# EAGLE design facetHound_base_module_v12 (EAGLE 9.6.2)
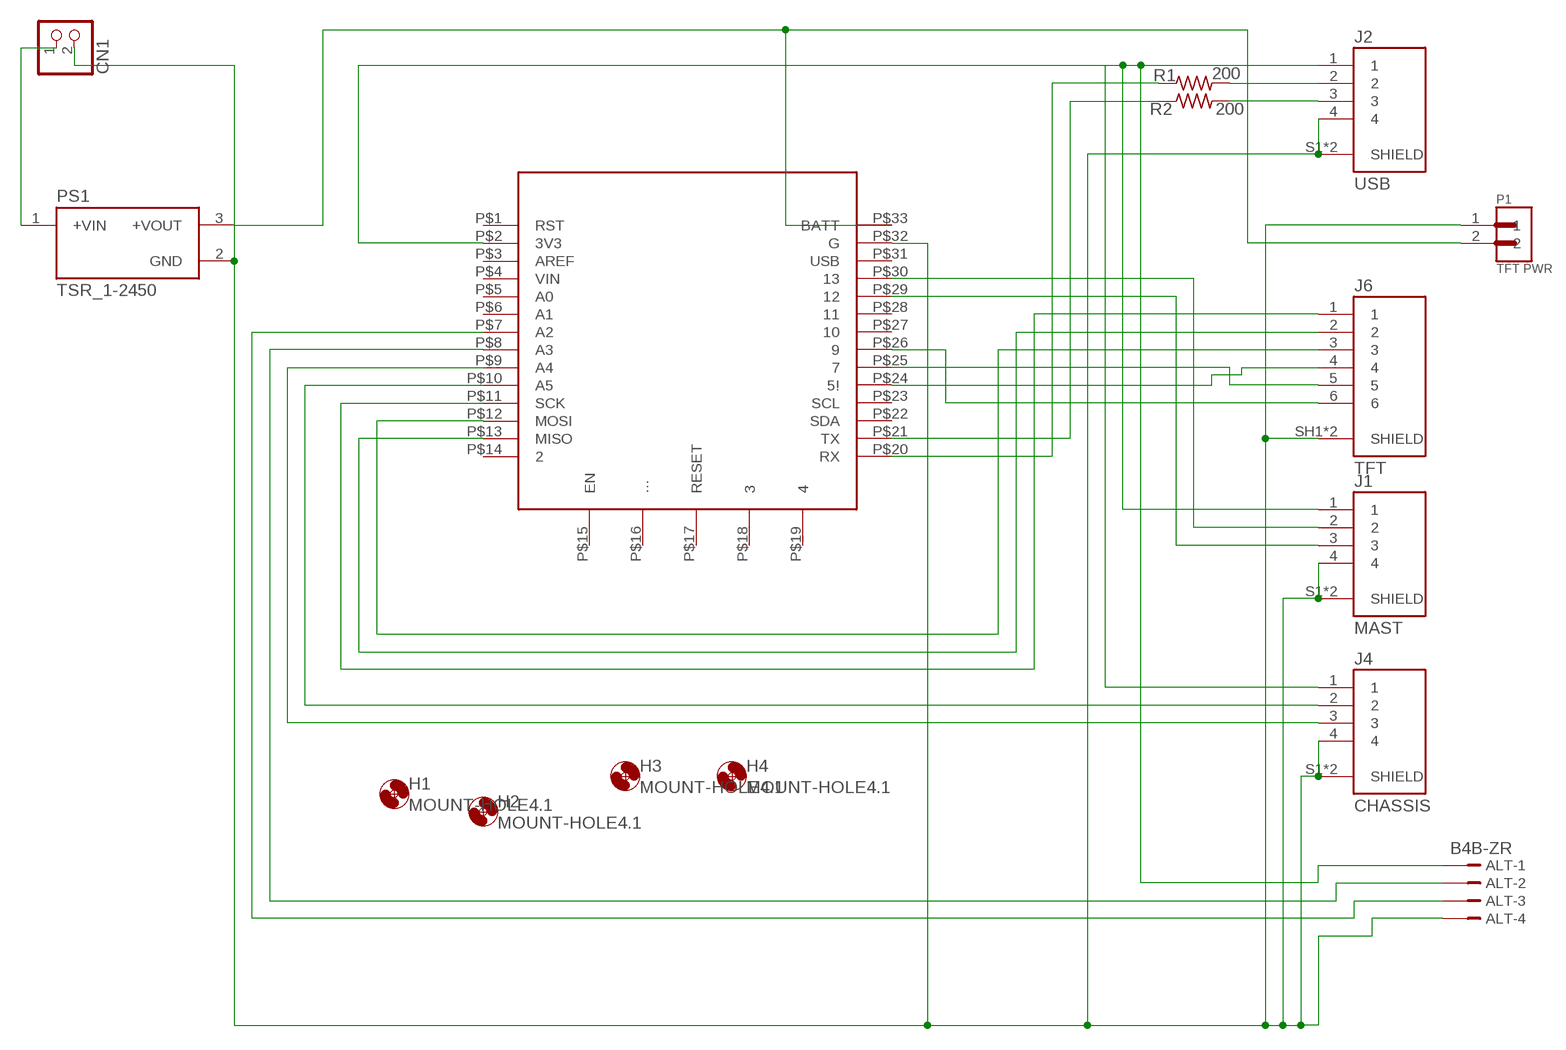
[diagram p0: schematic, sheet 1]

## Parts
ALT  B4B-ZR  [B4B-ZR]
CN1  JST_2PIN-THM-RA  [JST-PH-2-THM-RA]
H1  MOUNT-HOLE4.1  [4,1]
H2  MOUNT-HOLE4.1  [4,1]
H3  MOUNT-HOLE4.1  [4,1]
H4  MOUNT-HOLE4.1  [4,1]
J1  MAST  S4B-ZR-SM4A-TF(LF)(SN)  [JST_S4B-ZR-SM4A-TF(LF)(SN)]
J2  USB  S4B-ZR-SM4A-TF(LF)(SN)  [JST_S4B-ZR-SM4A-TF(LF)(SN)]
J4  CHASSIS  S4B-ZR-SM4A-TF(LF)(SN)  [JST_S4B-ZR-SM4A-TF(LF)(SN)]
J6  TFT  S6B-ZR-SM4A-TF(LF)(SN)  [JST_S6B-ZR-SM4A-TF(LF)(SN)]
P1  TFT PWR  S2B-ZR-SM4A-TF  [JST_S2B-ZR-SM4A-TF]
PS1  TSR_1-2450  [CONV_TSR_1-2450]
R1  200  R-US_M1206  [M1206]
R2  200  R-US_M1206  [M1206]
U$1  ITSYBITSY_M4  [ITSYBITSY_M4]

## Nets
GND: ALT.4 CN1.2 J1.4 J1.S1(SHIELD) J1.S2(SHIELD) J2.4 J2.S1(SHIELD) J2.S2(SHIELD) J4.4 J4.S1(SHIELD) J4.S2(SHIELD) J6.SH1(SHIELD) J6.SH2(SHIELD) P1.1 PS1.2(GND) U$1.P$32(G)
N$1: CN1.1 PS1.1(+VIN)
N$2: P1.2 PS1.3(+VOUT) U$1.P$33(BATT)
N$3: R2.1 U$1.P$21(TX)
N$4: ALT.3 U$1.P$7(A2)
N$5: J6.1 U$1.P$11(SCK)
N$6: ALT.1 J1.1 J2.1 J4.1 U$1.P$2(3V3)
N$7: J6.2 U$1.P$13(MISO)
N$8: J2.2 R1.2
N$9: R1.1 U$1.P$20(RX)
N$10: J6.3 U$1.P$12(MOSI)
N$11: J6.5 U$1.P$25
N$12: J6.4 U$1.P$24(5!)
N$13: J6.6 U$1.P$26
N$14: J1.2 U$1.P$30
N$15: J1.3 U$1.P$29
N$16: J4.2 U$1.P$10(A5)
N$17: J4.3 U$1.P$9(A4)
N$19: J2.3 R2.2
N$21: ALT.2 U$1.P$8(A3)
Unconnected: U$1.P$1(RST) U$1.P$3(AREF) U$1.P$4(VIN) U$1.P$5(A0) U$1.P$6(A1) U$1.P$14 U$1.P$15(EN) U$1.P$16(...) U$1.P$17(RESET) U$1.P$18 U$1.P$19 U$1.P$22(SDA) U$1.P$23(SCL) U$1.P$27 U$1.P$28 U$1.P$31(USB)

## Library data of the parts
ALT = con-jst:?4B-ZR: ZH CONNECTOR 1.5 mm, 4 pin 1 row Source: http://www.jst.com .. eZH.pdf; MF: FARNELL; MPN: B4B-ZR(LF)(SN); OC_FARNELL: 1830916; OC_NEWARK: 37K9960
CN1 = adafruit:JST_2PIN: JST 2-Pin Connectors of various flavors SMT-RA (S2B-PH-SM4) 4UConnector #17311 SMT (B2B-PH-SM4) THM-RA (S2B-PH) THM (B2B-PH)
H1-H4 = holes:MOUNT-HOLE: MOUNTING HOLE with drill center marker
J1 J2 J4 = S4B-ZR-SM4A-TF_LF__SN_:S4B-ZR-SM4A-TF(LF)(SN): Check availability <https://pricing.snapeda.com/parts/S4B-ZR-SM4A-TF%28LF%29%28SN%29/JST%20Sales/view-part?ref=eda>; AVAILABILITY: In Stock; CHECK_PRICES: https://www.snapeda.com/parts/S4B-ZR-SM4A-TF(LF)(SN)/JST/view-part/?ref=eda; DESCRIPTION: Connector Header Surface Mount, Right Angle 4 position 0.059 (1.50mm); MF: JST Sales; MP: S4B-ZR-SM4A-TF(LF)(SN); PACKAGE: None; PRICE: None; SNAPEDA_LINK: https://www.snapeda.com/parts/S4B-ZR-SM4A-TF(LF)(SN)/JST/view-part/?ref=snap
J6 = S6B-ZR-SM4A-TF_LF__SN_:S6B-ZR-SM4A-TF(LF)(SN): Check availability <https://pricing.snapeda.com/parts/S6B-ZR-SM4A-TF%28LF%29%28SN%29/JST%20Sales%20America%20Inc./view-part?ref=eda>; AVAILABILITY: In Stock; CHECK_PRICES: https://www.snapeda.com/parts/S6B-ZR-SM4A-TF(LF)(SN)/JST/view-part/?ref=eda; DESCRIPTION: Connector Header Surface Mount, Right Angle 6 position 0.059 (1.50mm); MF: JST Sales America Inc.; MP: S6B-ZR-SM4A-TF(LF)(SN); PACKAGE: None; PRICE: None; SNAPEDA_LINK: https://www.snapeda.com/parts/S6B-ZR-SM4A-TF(LF)(SN)/JST/view-part/?ref=snap
P1 = S2B-ZR-SM4A-TF:S2B-ZR-SM4A-TF: Check availability <https://pricing.snapeda.com/parts/S2B-ZR-SM4A-TF/JST%20Sales/view-part?ref=eda>; AVAILABILITY: In Stock; CHECK_PRICES: https://www.snapeda.com/parts/S2B-ZR-SM4A-TF/JST/view-part/?ref=eda; DESCRIPTION: Connector Header Surface Mount, Right Angle 2 position 0.059 (1.50mm); MF: JST Sales; MP: S2B-ZR-SM4A-TF; PACKAGE: None; PRICE: None; SNAPEDA_LINK: https://www.snapeda.com/parts/S2B-ZR-SM4A-TF/JST/view-part/?ref=snap
PS1 = TSR_1-2450:TSR_1-2450; MANUFACTURER: Traco Power; MAXIMUM_PACKAGE_HEIGHT: 10.6mm; PARTREV: Apr 27, 2020; STANDARD: Manufacturer Recommendations
R1 R2 = adafruit:R-US_: RESISTOR, American symbol
U$1 = itsyBitsy:ITSYBITSY_M4

## Board
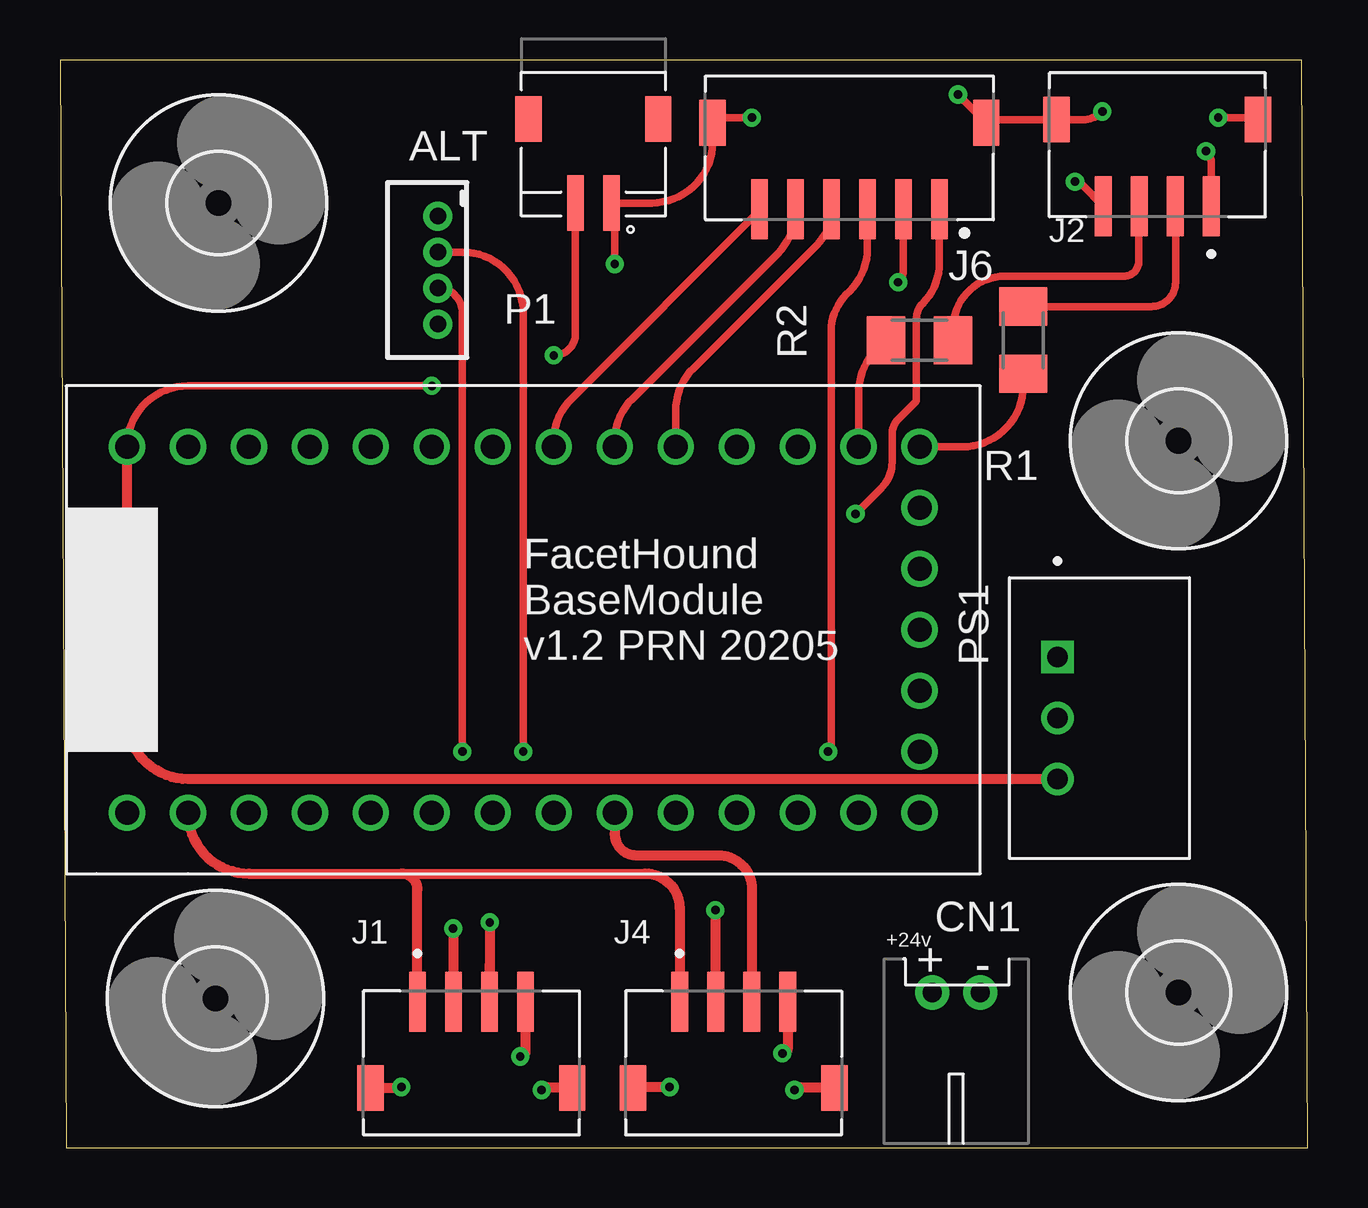
[diagram p1: board, top side]
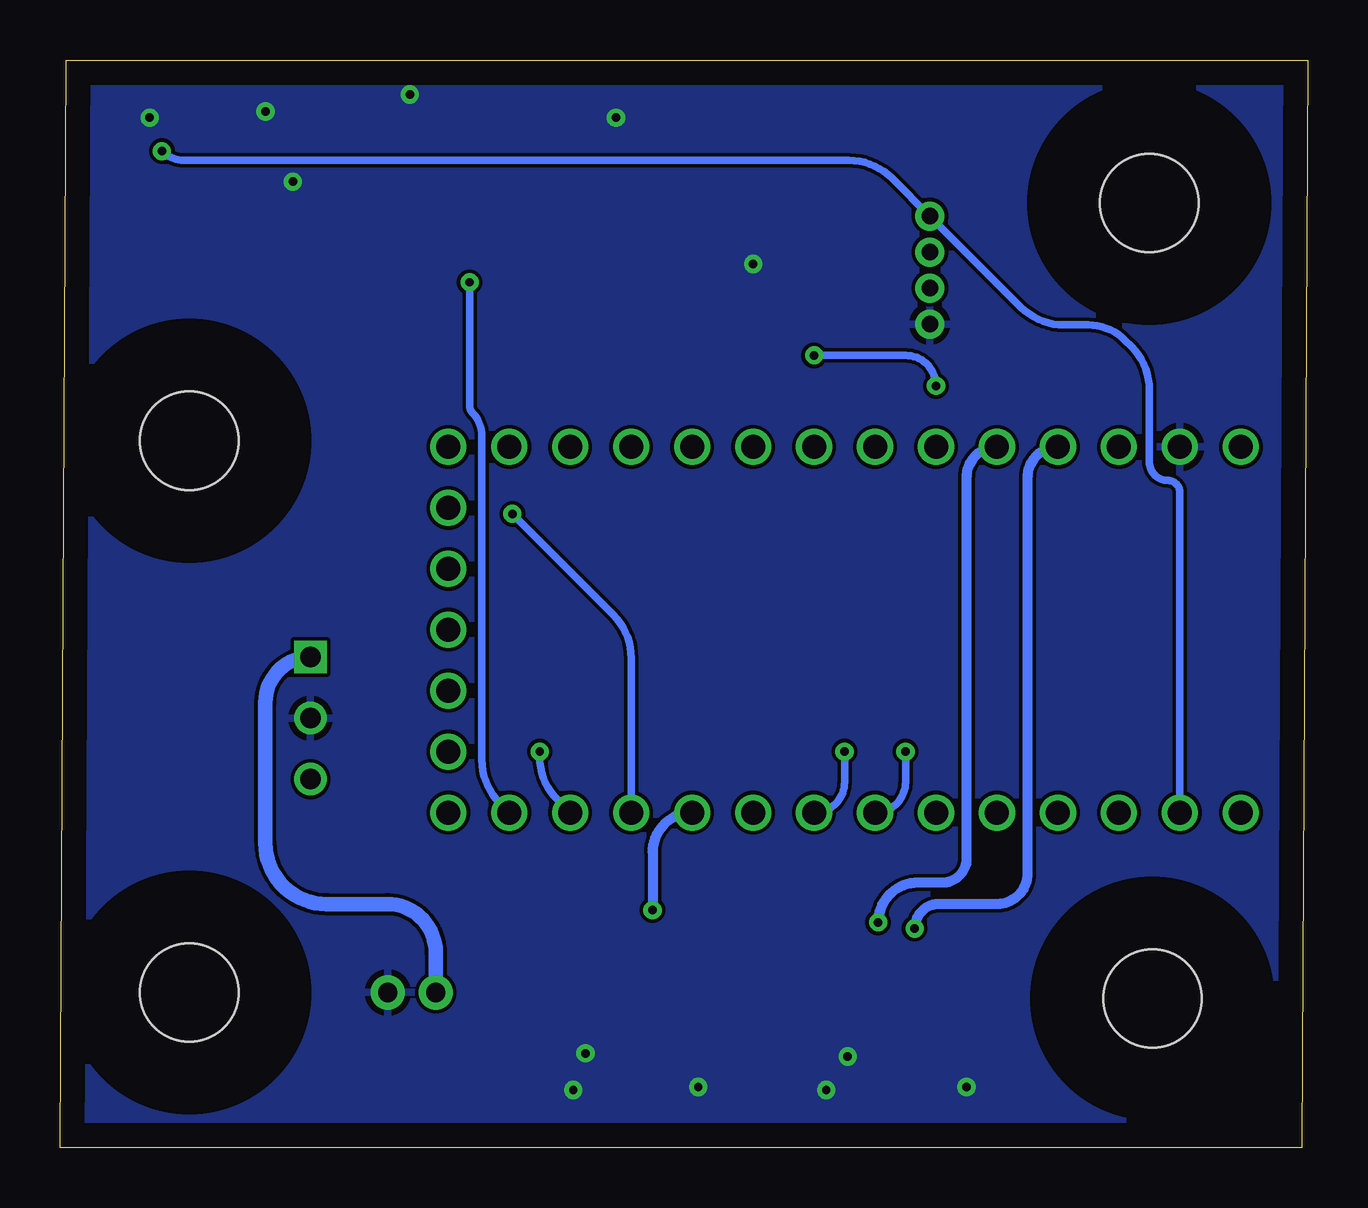
[diagram p2: board, bottom side, seen from below]

Size 51.99 x 45.33 mm. Coordinates in mm from the lower left corner, seen from the top.
Outline: 0.25,0 51.99,0 51.74,45.33 0,45.33 0.25,0
Copper layers (1*16): Top 0.035mm / dielectric 1.5mm / Bottom 0.035mm
Design rules "default": minimum track width 6mil, minimum drill 0.35mm, track to track 6mil, track to pad 6mil, pad to pad 6mil, via to via 6mil, smd to smd 6mil, copper to edge 40mil, drill to drill 6mil, minimum pad ring 10mil, minimum via ring 8mil, stop-mask expansion 4mil, vias tented up to drill 0mil, thermal gap 10mil

### Footprints (pad centres in the part's own frame; a part is rotated, then mirrored left to right if it is on the bottom)
B4B-ZR = drill 0.7 pad 1.1: 1 -2.25,0; 2 -0.75,0; 3 0.75,0; 4 2.25,0
JST-PH-2-THM-RA = drill 0.8 pad 1.422: 1 1,0; 2 -1,0
4,1 = hole 4.1: 0,0
JST_S4B-ZR-SM4A-TF(LF)(SN) = smd 0.7 x 2.5: 1 -2.25,0; 2 -0.75,0; 3 0.75,0; 4 2.25,0 | smd 1.1 x 1.9: S1 -4.2,-3.6; S2 4.2,-3.6
JST_S6B-ZR-SM4A-TF(LF)(SN) = smd 0.7 x 2.5: 1 -3.75,0; 2 -2.25,0; 3 -0.75,0; 4 0.75,0; 5 2.25,0; 6 3.75,0 | smd 1.1 x 1.9: SH1 -5.7,-3.6; SH2 5.7,-3.6
JST_S2B-ZR-SM4A-TF = smd 0.7 x 2.3: 1 0.75,0; 2 -0.75,0 | smd 1.1 x 1.9: P1 2.7,3.5; P2 -2.7,3.5
CONV_TSR_1-2450 = drill 0.85 square: 1 -2.54,-1.75 | drill 0.85: 2 0,-1.75; 3 2.54,-1.75
M1206 = smd 1.6 x 2: 1 -1.4,0; 2 1.4,0
ITSYBITSY_M4 = drill 1: P$1 -11.43,8.89; P$2 -11.43,6.35; P$3 -11.43,3.81; P$4 -11.43,1.27; P$5 -11.43,-1.27; P$6 -11.43,-3.81; P$7 -11.43,-6.35; P$8 -11.43,-8.89; P$9 -11.43,-11.43; P$10 -11.43,-13.97; P$11 -11.43,-16.51; P$12 -11.43,-19.05; P$13 -11.43,-21.59; P$14 -11.43,-24.13; P$15 -8.89,-24.13; P$16 -6.35,-24.13; P$17 -3.81,-24.13; P$18 -1.27,-24.13; P$19 1.27,-24.13; P$20 3.81,-24.13; P$21 3.81,-21.59; P$22 3.81,-19.05; P$23 3.81,-16.51; P$24 3.81,-13.97; P$25 3.81,-11.43; P$26 3.81,-8.89; P$27 3.81,-6.35; P$28 3.81,-3.81; P$29 3.81,-1.27; P$30 3.81,1.27; P$31 3.81,3.81; P$32 3.81,6.35; P$33 3.81,8.89

### Placement (x,y rotation side)
ALT  15.75,36.58 270 top
CN1  37.34,6.48 180 top
H1  46.61,29.46 0 top
H2  6.6,39.37 0 top
H3  46.61,6.48 0 top
H4  6.48,6.22 0 top
J1  17.14,6.1 0 top
J2  45.72,39.24 180 top
J4  28.07,6.1 0 top
J6  32.89,39.12 180 top
P1  22.23,39.37 0 top
PS1  43.31,17.91 270 top
R1  40.13,33.66 90 top
R2  35.81,33.66 0 top
U$1  11.68,25.4 90 top

### Tracks (layer width: path | path; a pad name or v marks a point on that pad's centre or on a via)
GND  (via drill 0.35)
  Top 0.305: 38.55,42.67 arc-45 38.96,42.84 J2.S2 42.62,42.84 arc45 v43.43,43.18 | v28.83,42.93 27.7,42.93 arc45 J6.SH2 27.19,41.91 arc-90 24.65,39.37 P1.1 arc-90 23.11,39.23 v23.11,36.83 | J6.SH1 v37.42,43.89 | J2.S1 arc45 49.72,42.93 v48.26,42.93 | 43.47,38.46 J2.4 42.57,40.14 arc45 v42.29,40.26
  Top 0.406: J1.S1 14.18,2.5 arc90 v14.22,2.54 | J1.4 19.39,4.03 arc-90 v19.18,3.81 | J1.S2 20.15,2.5 arc90 v20.07,2.41 | J4.S1 arc-90 23.91,2.54 v25.4,2.54 | J4.4 30.32,4.16 arc-90 v30.1,3.94 | J4.S2 30.69,2.5 arc90 v30.61,2.41 | 38.55,42.67 arc90 J6.SH1
  pour Bottom: 0.25,45.72 52.32,45.72 52.32,0 0.25,0 0.25,1.27
N$1
  Bottom 0.61: CN1.1 36.34,8.14 arc-90 38.35,10.16 40.89,10.16 arc90 43.43,12.7 43.43,18.57 arc90 PS1.1
N$2  (via drill 0.35)
  Top 0.305: U$1.P$33 arc-90 5.33,31.75 v15.49,31.75 | v20.57,33.02 arc90 21.48,33.92 P1.2
  Top 0.406: 41.45,15.26 arc90 PS1.3 5.33,15.37 arc-90 2.79,17.91 U$1.P$33
  Bottom 0.305: v15.49,31.75 arc-90 16.76,33.02 v20.57,33.02
N$3
  Top 0.305: U$1.P$21 33.27,31.46 arc-45 34.02,33.26 R2.1
N$4  (via drill 0.35)
  Top 0.305: ALT.3 arc-90 16.76,34.81 v16.76,16.51
  Bottom 0.305: v16.76,16.51 16.76,15.24 arc90 U$1.P$7
N$5  (via drill 0.35)
  Top 0.305: J6.1 36.64,36.87 arc-45 35.94,35.18 arc45 35.69,34.57 35.69,31.24 arc-45 35.6,31.02 34.92,30.35 arc45 34.67,29.74 34.67,28.57 arc-45 34.22,27.49 v33.15,26.42
  Bottom 0.305: v33.15,26.42 28.94,22.21 arc45 28.19,20.41 U$1.P$11
N$6  (via drill 0.35)
  Top 0.305: v47.75,41.53 arc-45 47.97,41 J2.1
  Top 0.406: 14.99,6.19 arc-90 J1.1 14.89,10.76 arc90 14.22,11.43 | U$1.P$2 arc90 7.87,11.43 14.22,11.43 | 14.22,11.43 24.38,11.43 arc-90 25.82,10 J4.1
  Bottom 0.305: U$1.P$2 5.33,27.3 arc-90 5.84,27.81 arc90 6.6,28.57 6.6,31.59 arc-45 7.35,33.38 7.62,33.66 arc-45 9.15,34.29 10.16,34.29 arc45 11.96,35.03 ALT.1 17.33,40.4 arc-45 19.12,41.15 46.83,41.15 arc45 v47.75,41.53
N$7  (via drill 0.35)
  Top 0.305: J6.2 35.14,36.59 arc-45 v34.92,36.07
  Bottom 0.305: v34.92,36.07 34.92,30.91 arc-45 34.8,30.61 arc45 34.42,29.69 34.42,16.16 arc-45 33.67,14.37 U$1.P$13
N$8
  Top 0.305: R1.2 45.47,35.05 arc90 46.48,36.07 J2.2 arc90 J2.2
N$9
  Top 0.305: U$1.P$20 37.59,29.21 arc90 40.13,31.75 R1.1
N$10  (via drill 0.35)
  Top 0.305: J6.3 33.64,37.49 arc-45 32.9,35.69 32.77,35.56 arc45 32.13,34.03 32.13,16.82 arc-45 v32,16.51
  Bottom 0.305: v32,16.51 32,16.29 arc-45 31.26,14.5 U$1.P$12
N$11
  Top 0.305: U$1.P$25 23.11,29.43 arc-45 23.86,31.22 29.9,37.27 arc45 30.64,39.06 J6.5
N$12
  Top 0.305: U$1.P$24 25.65,30.7 arc-45 26.4,32.49 31.52,37.62 arc45 J6.4
N$13
  Top 0.305: U$1.P$26 20.57,29.43 arc-45 21.32,31.22 29.1,39 arc45 J6.6
N$14  (via drill 0.35)
  Top 0.406: 16.39,6.35 J1.2 v16.39,9.13 arc90 v16.38,9.14
  Bottom 0.406: U$1.P$30 arc-90 11.68,27.94 11.68,11.43 arc90 12.95,10.16 15.37,10.16 arc-90 v16.38,9.14
N$15  (via drill 0.35)
  Top 0.406: 17.89,7.62 17.89,6.35 | 17.89,6.35 J1.3 | v17.91,9.4 17.91,6.36 arc-90 17.89,6.35
  Bottom 0.406: U$1.P$29 arc-90 14.22,27.94 14.22,12.06 arc90 15.24,11.05 16.26,11.05 arc-90 v17.91,9.4
N$16  (via drill 0.35)
  Top 0.406: v27.3,9.91 J4.2 arc90 J4.2
  Bottom 0.406: U$1.P$10 arc-90 27.3,12.32 v27.3,9.91
N$17
  Top 0.406: U$1.P$9 23.11,13.08 arc90 24,12.19 27.43,12.19 arc-90 28.83,10.79 28.83,6.11 arc-90 J4.3
N$19
  Top 0.305: R2.2 37.21,34.17 arc-90 39.37,36.32 44.32,36.32 arc90 44.96,36.96 44.96,39.23 arc-90 J2.3
N$21  (via drill 0.35)
  Top 0.305: ALT.2 16.76,37.33 arc-90 19.3,34.79 v19.3,16.51
  Bottom 0.305: v19.3,16.51 19.3,15.24 arc90 U$1.P$8

### Text on the board
tPlace: FacetHound / BaseModule / v1.2 PRN 20205
tNames: +24v